# Altium schematic sheet MicroController.SchDoc
size A
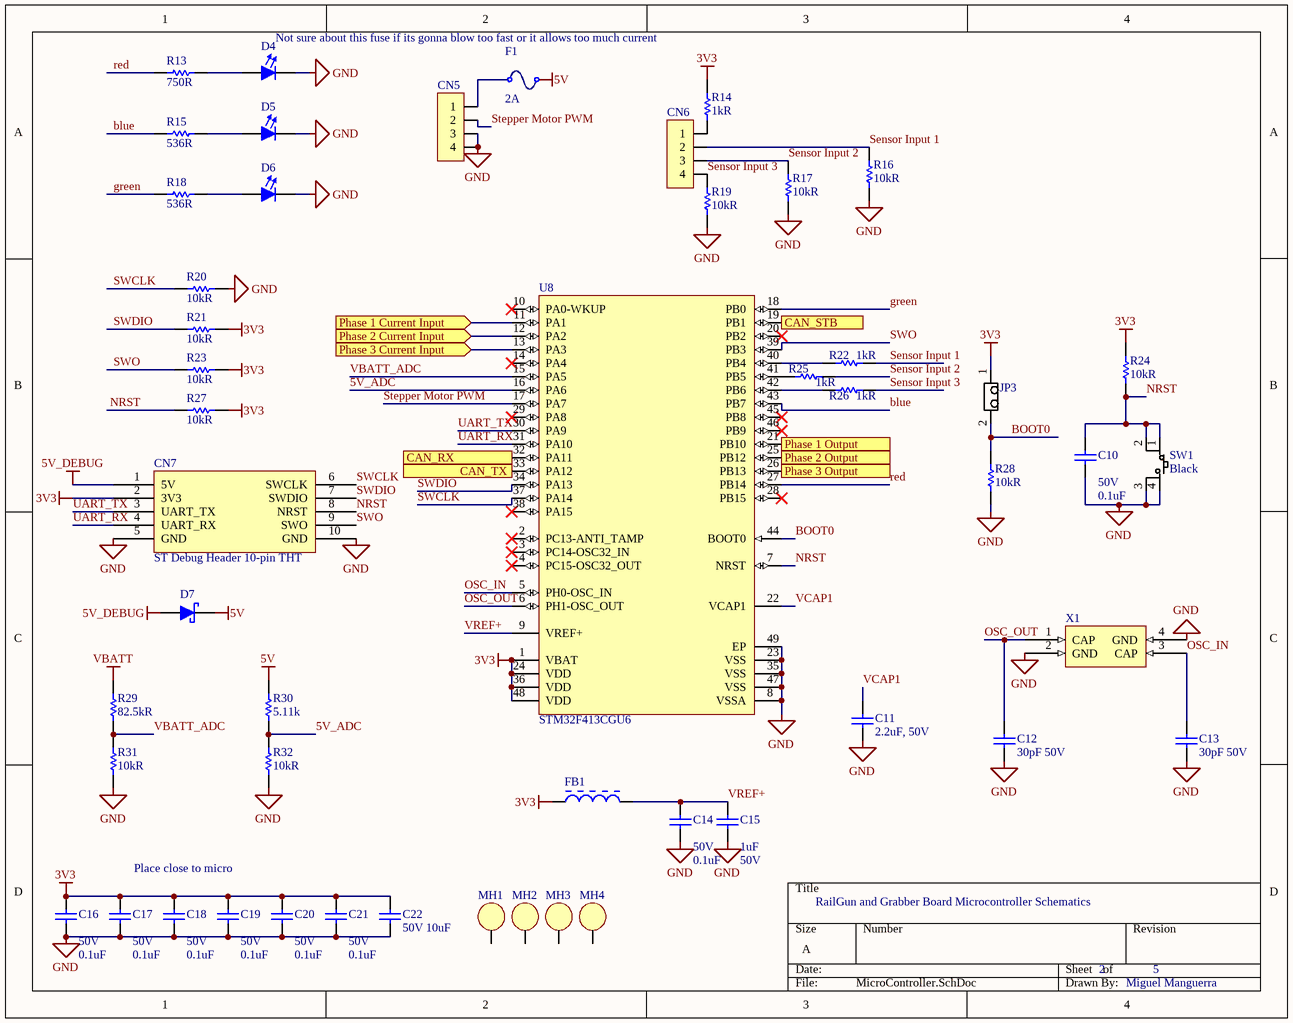
[diagram p0: MicroController.SchDoc]

## Parts
C10  Voltage: 50V  Capacitance: 0.1uF  [FP-CL10-0_1-MFG]  (hidden comment: CL10B104JB8NNNC)
C11  2.2uF, 50V  [CAPC1608N(0603")]
C12  30pF 50V  [CAPC1608N(0603")]
C13  30pF 50V  [CAPC1608N(0603")]
C14  Voltage: 50V  Capacitance: 0.1uF  [FP-CL10-0_1-MFG]  (hidden comment: CL10B104JB8NNNC)
C15  Capacitance: 1uF  Voltage: 50V  [0803 CAP]  (hidden comment: CL21B105KBFNNNG)
C16  Voltage: 50V  Capacitance: 0.1uF  [FP-CL10-0_1-MFG]  (hidden comment: CL10B104JB8NNNC)
C17  Voltage: 50V  Capacitance: 0.1uF  [FP-CL10-0_1-MFG]  (hidden comment: CL10B104JB8NNNC)
C18  Voltage: 50V  Capacitance: 0.1uF  [FP-CL10-0_1-MFG]  (hidden comment: CL10B104JB8NNNC)
C19  Voltage: 50V  Capacitance: 0.1uF  [FP-CL10-0_1-MFG]  (hidden comment: CL10B104JB8NNNC)
C20  Voltage: 50V  Capacitance: 0.1uF  [FP-CL10-0_1-MFG]  (hidden comment: CL10B104JB8NNNC)
C21  Voltage: 50V  Capacitance: 0.1uF  [FP-CL10-0_1-MFG]  (hidden comment: CL10B104JB8NNNC)
C22  50V 10uF  [CAPC3216X180X50LL20T30]
CN5  Header, Male, 1x4, RA, Pitch 0.1" (2.54mm)  [HEADER, MALE, SHROUDED, 4x1, PITCH 0.1" (2.54mm), RA]  (value not drawn)
CN6  Header, Male, 1x4, RA, Pitch 0.1" (2.54mm)  [HEADER, MALE, SHROUDED, 4x1, PITCH 0.1" (2.54mm), RA]  (value not drawn)
CN7  ST Debug Header 10-pin THT  [10-pin shrouded header THT]
D4  LSQ976-NR-1  [FP-LB_Q39E-MFG]  (value not drawn)
D5  LBQ39E-N1OO-35-1  [FP-LB_Q39E-MFG]  (value not drawn)
D6  LT Q39G-Q1OO-25-1  [FP-LB_Q39E-MFG]  (value not drawn)
D7  CUS08F30,H3F  [SC-76]  (value not drawn)
F1  Current: 2A  [1206 SMD]  (hidden comment: SMD Fuse, 2A, 63V,)
FB1  BLM18AG601SN1D  [MURA-BLM18-F-H1-CHIP-2_V]  (value not drawn)
JP3  1x2 Male Header  [2X1 Males Header]  (value not drawn)
MH1  Mount_Hole_3mm  [Mount-Hole_3mm]  (value not drawn)
MH2  Mount_Hole_3mm  [Mount-Hole_3mm]  (value not drawn)
MH3  Mount_Hole_3mm  [Mount-Hole_3mm]  (value not drawn)
MH4  Mount_Hole_3mm  [Mount-Hole_3mm]  (value not drawn)
R13  750R  [RESC0603(1608)_N]
R14  1kR  [RESC1608N(0603")]
R15  536R  [RESC1608X55X30LL15T15]
R16  10kR  [RESC1608N(0603")]
R17  10kR  [RESC1608N(0603")]
R18  536R  [RESC1608X55X30LL15T15]
R19  10kR  [RESC1608N(0603")]
R20  10kR  [RESC1608N(0603")]
R21  10kR  [RESC1608N(0603")]
R22  1kR  [RESC1608N(0603")]
R23  10kR  [RESC1608N(0603")]
R24  10kR  [RESC1608N(0603")]
R25  1kR  [RESC1608N(0603")]
R26  1kR  [RESC1608N(0603")]
R27  10kR  [RESC1608N(0603")]
R28  10kR  [RESC1608N(0603")]
R29  Resistance: 82.5kR  [RESC1608X55X30LL15T15]  (hidden comment: ERJ-3EKF8252V)
R30  value 5.11k  [RESC1608N(0603")]  (hidden comment: 5.11kR, 1%, 1/10W, 0603, SMD)
R31  Resistance: 10kR  [RESC1608X55X25NL10T15]  (hidden comment: RC0603FR-0710KL)
R32  Resistance: 10kR  [RESC1608X55X25NL10T15]  (hidden comment: RC0603FR-0710KL)
SW1  Button Colour: Black  [4-SPST-NO]  (hidden comment: PTS645SL43SMTR92LFS)
U8  STM32F413CGU6  [STM-UFQFPN48_N]
X1  CRYSTAL 8.0MHZ 16PF SMD  [QFN250P750X520X140_HS-5M]  (value not drawn)

## Ports
CAN_RX (in), CAN_STB (out), CAN_TX (out), Phase 1 Current Input (in), Phase 1 Output (out), Phase 2 Current Input (in), Phase 2 Output (out), Phase 3 Current Input (in), Phase 3 Output (out)

## Nets
3V3: C16.1 C17.1 C18.1 C19.1 C20.1 C21.1 C22.1 CN7.2(3V3) FB1.1 JP3.1 R14.1 R21.1 R23.1 R24.1 R27.1 U8.1(VBAT) U8.24(VDD) U8.36(VDD) U8.48(VDD)
5V: D7.K(Cathode) F1.2 R30.1
5V_DEBUG: CN7.1(5V) D7.A(Anode)
GND: C10.2 C11.2(Cathode) C12.2 C13.2 C14.2 C15.2 C16.2 C17.2 C18.2 C19.2 C20.2 C21.2 C22.2 CN5.3 CN5.4 CN7.5(GND) CN7.10(GND) D4.1(Cathode) D5.1(Cathode) D6.1(Cathode) R16.2 R17.2 R19.2 R20.1 R28.2 R31.2 R32.2 SW1.3 SW1.4 U8.8(VSSA) U8.23(VSS) U8.35(VSS) U8.47(VSS) U8.49(EP) X1.2(GND) X1.4(GND)
VBATT: R29.1
5V_ADC: R30.2 R32.1 U8.16(PA6)
blue: R15.1 U8.43(PB7)
BOOT0: JP3.2 R28.1 U8.44(BOOT0)
CAN_RX: U8.32(PA11) ; port CAN_RX
CAN_STB: U8.19(PB1) ; port CAN_STB
CAN_TX: U8.33(PA12) ; port CAN_TX
green: R18.1 U8.18(PB0)
NRST: C10.1 CN7.8(NRST) R24.2 R27.2 SW1.1 SW1.2 U8.7(NRST)
OSC_IN: C13.1 U8.5(PH0-OSC_IN) X1.3(CAP)
OSC_OUT: C12.1 U8.6(PH1-OSC_OUT) X1.1(CAP)
Phase 1 Current Input: U8.11(PA1) ; port Phase 1 Current Input
Phase 1 Output: U8.21(PB10) ; port Phase 1 Output
Phase 2 Current Input: U8.12(PA2) ; port Phase 2 Current Input
Phase 2 Output: U8.25(PB12) ; port Phase 2 Output
Phase 3 Current Input: U8.13(PA3) ; port Phase 3 Current Input
Phase 3 Output: U8.26(PB13) ; port Phase 3 Output
red: R13.1 U8.27(PB14)
Sensor Input 1: CN6.2 R16.1 R22.2
Sensor Input 2: CN6.3 R17.1 R25.2
Sensor Input 3: CN6.4 R19.1 R26.2
Stepper Motor PWM: CN5.2 U8.17(PA7)
SWCLK: CN7.6(SWCLK) R20.2 U8.37(PA14)
SWDIO: CN7.7(SWDIO) R21.2 U8.34(PA13)
SWO: CN7.9(SWO) R23.2 U8.39(PB3)
UART_RX: CN7.4(UART_RX) U8.31(PA10)
UART_TX: CN7.3(UART_TX) U8.30(PA9)
VBATT_ADC: R29.2 R31.1 U8.15(PA5)
VCAP1: C11.1(Anode) U8.22(VCAP1)
VREF+: C14.1 C15.1 FB1.2 U8.9(VREF+)
NetCN5_1: CN5.1 F1.1
NetCN6_1: CN6.1 R14.2
NetD4_2: D4.2(Anode) R13.2
NetD5_2: D5.2(Anode) R15.2
NetD6_2: D6.2(Anode) R18.2
NetR22_1: R22.1 U8.40(PB4)
NetR25_1: R25.1 U8.41(PB5)
NetR26_1: R26.1 U8.42(PB6)

Not connected (* = marked no-connect by the designer): MH1 1; MH2 1; MH3 1; MH4 1; U8 2(PC13-ANTI_TAMP)* 3(PC14-OSC32_IN)* 4(PC15-OSC32_OUT)* 10(PA0-WKUP)* 14(PA4)* 20(PB2)* 28(PB15)* 29(PA8)* 38(PA15)* 45(PB8)* 46(PB9)*

## Notes on the sheet
- Not sure about this fuse if its gonna blow too fast or it allows too much current
- Place close to micro
- RailGun and Grabber Board Microcontroller Schematics
- 2
- 5
- Miguel Manguerra

## Library data of the parts
C10 C14 C16-C21 = CMP-00000-3: CAP CER 0.1UF 50V X7R 0603; Tolerance: 5%; Material: Ceramic; Case Code (Imperial): 0603; Mount: Surface Mount; Thickness: 0.035inch; Depth: 0.8mm; Packaging: Tape and Reel; Package Quantity: 1; Dielectric: X7R; Height: 0.8mm; Radiation Hardening: No; Max Operating Temperature: 125°C; Voltage Rating: 50V; Case/Package: 0603; Min Operating Temperature: -55°C; Case Code (Metric): 1608; Length: 1.6mm; Contact Plating: Tin; Width: 0.031inch
C11 = CMP-006-0030-1: Capacitor, Ceramic, 50V, 10%, 0603 SMD, X5R; Value: 2.2µF; Date Created: *; Design Item ID: 2.2uF, 50V, 0603 SMD, X5R, Ceramic; Made By: *; Publisher: AUVic; Source: AUVic_Schematic_Library_Capacitors.SchLib; Pin Count: 2; PackageDescription: Chip Capacitor; Component Type: Standard
C12 C13 = CMP-006-0040-1: Capacitor, Ceramic, 50V, +/-1%, 0603 SMD, C0G; Made By: Andy Bates; Design Item ID: 30pF 50V 0603 SMD, Ceramic; Value: 30pF; PackageDescription: Chip Capacitor; Source: AUVic_Schematic_Library_Capacitors.SchLib; Publisher: AUVic; Pin Count: 2; Published: 16-09-12; Component Type: Standard
C15 = CMP-00005-1: SAMSUNG ELECTRO-MECHANICS - CL21B105KBFNNNG - MLCC CAPACITORS; Tolerance: 10%; Material: Ceramic; Dielectric: X7R; Case/Package: 0805; Voltage Rating: 50V; Contact Plating: Tin; Max Operating Temperature: 125°C; Termination: Wraparound; Package Quantity: 3000; Depth: 1.25mm; Mount: Surface Mount; Min Operating Temperature: -55°C; Thickness: 0.053inch; Packaging: Tape and Reel; Case Code (Metric): 2012; Length: 2mm; Case Code (Imperial): 0805; Width: 0.049inch
C22 = CMP-00004-1: Cap Ceramic 10uF 50V X7R 10% Pad SMD 1206 125°C T/R; Thickness: 0.071inch; Case/Package: 1206; Case Code (Metric): 3216; Case Code (Imperial): 1206; Voltage Rating: 50V; Length: 0.126inch; Max Operating Temperature: 125°C; Voltage Rating (DC): 50V; Capacitance: 10uF; Dielectric: X7R; Lead Free: Lead Free; Min Operating Temperature: -55°C; Tolerance: 10%; Mount: Surface Mount; Packaging: Tape and Reel; Width: 0.063inch
CN5 CN6 = CMP-005-0029-3: Connector Header Through Hole, Right Angle 4 position 0.100" (2.54mm); Source: AUVic_Schematic_Library_Connectors.SchLib; Created On: 2020-05-20; Pin Count: 4; Component Type: Standard; Design Item ID: Header, Male, 1x4, RA, Pitch 0.1" (2.54mm); Created By: Miguel Manguerra
CN7 = CMP-00011-6: CONN HEADER VERT 10POS 2.54MM; Row Spacing: 0.1inch; Connector Type: Male Pin; Number of Positions: 10; Packaging: Tray; Package Quantity: 1; Color: Black; Number of Rows: 2; Termination: Solder; Contact Plating: Gold; Lead Free: Lead Free; Pitch: 0.1inch; Mount: Through Hole
D4 = CMP-00066-2: LED Red 645nm 2-Pin Chip 0603(1608Metric) T/R; Lens Transparency: Diffused; Power Dissipation: 65mW; Forward Voltage: 2.5V; Dominant Wavelength: 633nm; Number of Elements: 1; Lens Style: Diffused,Flat,Colorless,Rectangular; Lens Color: White; Viewing Angle: 160°; Luminous Flux: 0.33lm; Test Current: 20mA; Forward Current: 25mA; Luminous Intensity: 180mcd; Reverse Voltage: 12V; Lens Size: 0.8mm; Max Operating Temperature: 85°C; Depth: 0.9mm; Illumination Color: Red; Color: Red; Packaging: Tape and Reel; Min Operating Temperature: -30°C; Case Code (Imperial): 0603; Case Code (Metric): 1608; Number of Pins: 2; Mount: Surface Mount; Height: 0.8mm; Package Quantity: 1; Length: 1.7mm; Width: 0.8mm; Number of LEDs: 1; Case/Package: 0603; Radiation Hardening: No
D5 = CMP-00063-3: LED BLUE DIFFUSED 0603 SMD; Luminous Flux: 0.13lm; Lens Size: 0.8mm; Lens Color: White; Viewing Angle: 130°; Luminous Intensity: 42mcd; Number of LEDs: 1; Dominant Wavelength: 470nm; Lens Style: Flat,Diffused,Colorless,Rectangular; Test Current: 5mA; Forward Voltage: 2.85V; Packaging: Tape and Reel; Case/Package: 0603; Height: 0.4mm; Number of Pins: 2; Mount: Surface Mount; Case Code (Metric): 1608; Case Code (Imperial): 0603; Lens Transparency: Diffused; Width: 0.8mm; Length: 1.6mm; Color: Blue; Radiation Hardening: No
D6 = CMP-00064-3: LED GREEN DIFFUSED 0603 SMD; Dominant Wavelength: 530nm; Luminous Intensity: 280mcd; Lens Style: Diffused,Colorless,Rectangular; Number of LEDs: 1; Forward Voltage: 2.85V; Test Current: 5mA; Reverse Voltage: 5V; Forward Current: 15mA; Luminous Flux: 0.55lm; Radiation Hardening: No; Packaging: Tape and Reel; Mount: Surface Mount; Color: Green; Max Operating Temperature: 85°C; Number of Elements: 1; Number of Pins: 2; Min Operating Temperature: -40°C; Depth: 0.9mm; Case/Package: SMD/SMT; Length: 1.7mm
D7 = CMP-057-0000-2: Diode Schottky 30V 800mA Surface Mount USC; Peak Non-Repetitive Surge Current: 5A; Element Configuration: Single; Peak Reverse Current: 50uA; Packaging: Tape and Reel; Mount: Surface Mount; Average Rectified Current: 800mA; Case/Package: SOD; Max Reverse Voltage (DC): 30V; Min Operating Temperature: -55°C; Contact Plating: Tin,Silver; Max Repetitive Reverse Voltage (Vrrm): 30V; Number of Pins: 2; Max Operating Temperature: 125°C
F1 = CMP-027-0004-1: Design Item ID: SMD Fuse, 2A, 63V,; Component Type: Standard; Source: AUVic_Integrated_Library_Fuses.SchLib; ComponentLink1Description: Digi-Key; Date Created: 2018-06-07; ComponentLink1URL: https://www.digikey.ca/product-detail/en/bel-fuse-inc/C1F-2/507-1881-1-ND/4968159; Type: SMD; Created By: Poorna Chander Kalidas; Pin Count: 2
FB1 = CMP-00016-1: MURATA - BLM18AG601SN1D - Feritový Korálek, 0603 / 1608, 600 ohm, 500 mA, Série BLM18A, 0.38 ohm, ± 25%; DC Current: 500mA; Impedance: 600R; DC Resistance (DCR): 380mR; Core Material: Ferrite; Shielding: Unshielded; Number of Lines: 1; Test Frequency: 100MHz; Material: Steel,Ferrite; Height: 0.8mm; Depth: 0.8mm; Min Operating Temperature: -55°C; Packaging: Tape and Reel; Weight: 7.1E-05oz; Width: 0.8mm; Military Standard: Not; Max Operating Temperature: 125°C; Max Current Rating: 500mA; Case Code (Metric): 1608; Length: 1.6mm; Case Code (Imperial): 0603; Package Quantity: 1; Max DC Current: 500mA; REACH SVHC: No SVHC; Termination: SMD/SMT; Current Rating: 500mA; Lead Free: Lead Free; Tolerance: 25%; Case/Package: 0603; Number of Pins: 2; Radiation Hardening: No; Frequency: 100MHz; Number of Circuits: 1
JP3 = CMP-004-0001-1: Made By: Andy Bates; Source: AUVic_Schematic_Library_Connectors.SchLib; Pin Count: 2; Design Item ID: 1x2 Male Header; Component Type: Standard
MH1-MH4 = CMP-004-0010-4: Mounting hold for M3 hex standoff; Source: AUVic_Schematic_Library_Connectors.SchLib; Design Item ID: Mount_Hole_3mm; Component Type: Standard; Pin Count: 1
R13 = CMP-00070-1: Res Thick Film 0603 750 Ohm 1% 0.1W(1/10W) ±100ppm/C Epoxy SMD T/R; Voltage Rating (DC): 50V; Power Rating: 100mW; Temperature Coefficient: 100ppm/°C; Height: 0.022inch; Tolerance: 1%; Voltage Rating: 50V; Case Code (Metric): 1608; Packaging: Tape and Reel; Depth: 0.8mm; Package Quantity: 1; Termination: SMD/SMT; Number of Terminations: 2; Min Operating Temperature: -55°C; Case/Package: 0603; Composition: Thick Film; Width: 0.031inch; Max Operating Temperature: 155°C; Max Power Dissipation: 100mW; Length: 1.6mm; Resistance: 750R; Military Standard: Not; Features: Moisture Resistant; Case Code (Imperial): 0603; Lead Free: Lead Free
R14 R22 R25 R26 = CMP-047-0024-1: 1kR, 1%, 1/10W , 0603, SMD; Value: 1k; Component Type: Standard; Publisher: AUVic; Source: AUVic_Schematic_Library_Resistors.SchLib; Date Created: 2017-05-10; Pin Count: 2; Created By: Andy Bates; Design Item ID: 1kR
R15 R18 = CMP-00071-1: SMD Chip Resistor, 0603 [1608 Metric], 536 ohm, ERJ3EK Series, 75 V, Thick Film, 100 mW; Tolerance: 1%; Voltage Rating (DC): 50V; Voltage Rating: 75V; Power Rating: 100mW; Temperature Coefficient: 100ppm/°C; Max Operating Temperature: 155°C; Package Quantity: 1; REACH SVHC: No SVHC; Depth: 0.8mm; Composition: Thick Film; Height: 0.022inch; Packaging: Tape and Reel; Contact Plating: Tin; Lead Free: Lead Free; Length: 1.6mm; Case/Package: 0603; Military Standard: Not; Features: Automotive AEC-Q200; Resistance: 536R; Termination: SMD/SMT; Max Power Dissipation: 100mW; Width: 0.8mm; Mount: Surface Mount; Case Code (Metric): 1608; Case Code (Imperial): 0603; Number of Terminations: 2; Min Operating Temperature: -55°C
R16 R17 R19-R21 R23 R24 R27 R28 = CMP-047-0013-1: 10kR, 1%, 1/10W, 0603 SMD; Owned By: AUVic; Made By: Ashwin Sira; Value: 10k; Design Item ID: 10kR; Pin Count: 2; Component Type: Standard; Created On: 14-05-31; Last Edited: 14-05-31; Source: AUVic_Schematic_Library_Resistors.SchLib
R29 = CMP-00085-1: RES SMD 82.5K OHM 1% 1/10W 0603; Power Rating: 100mW; Temperature Coefficient: 100ppm/°C; Voltage Rating (DC): 50V; Voltage Rating: 75V; Case/Package: 0603; Case Code (Imperial): 0603; Composition: Thick Film; Depth: 0.8mm; Min Operating Temperature: -55°C; Width: 0.031inch; Height: 0.022inch; Military Standard: Not; Packaging: Tape and Reel; Termination: SMD/SMT; Lead Free: Lead Free; Max Operating Temperature: 155°C; REACH SVHC: No SVHC; Case Code (Metric): 1608; Tolerance: 1%; Length: 1.6mm; Features: Automotive AEC-Q200; Package Quantity: 1; Max Power Dissipation: 100mW; Radiation Hardening: No; Contact Plating: Tin; Number of Terminations: 2; Mount: Surface Mount
R30 = CMP-047-0056-1: Resistance, Tolerance, Power, 0603, SMD/THT; Publisher: AUVic; Design Item ID: 5.11kR, 1%, 1/10W, 0603, SMD; Date Created: 09/28/2016; Pin Count: 2; Component Type: Standard; Created By: Jordan Day; Source: AUVic_Schematic_Library_Resistors.SchLib
R31 R32 = CMP-00037-1: Res General Purpose Thick Film 0603 10K Ohm 1% 1/10W ±100ppm/°C Molded SMD Paper T/R; Power Rating: 100mW; Voltage Rating (DC): 50V; Voltage Rating: 75V; Case/Package: 0603; Weight: 7.1E-05oz; Case Code (Imperial): 0603; Composition: Thick Film; Depth: 0.8mm; Min Operating Temperature: -55°C; Width: 0.8mm; Height: 0.45mm; Military Standard: Not; Packaging: Tape and Reel; Termination: SMD/SMT; Lead Free: Lead Free; Temperature Coefficient: 100ppm/°C; Number of Pins: 2; Max Operating Temperature: 155°C; Lead Pitch: 0.3mm; REACH SVHC: No SVHC; Case Code (Metric): 1608; Tolerance: 1%; Length: 1.6mm
SW1 = CMP-00077-1: Black Switch Tactile N.O. SPST Round Button Gull Wing 0.05A 12VDC 100000Cycles 1.27N SMD T/R; Actuator Material: Nylon,Polyamide; Switch Function: Off-Mom; Actuator Type: Standard; Illumination Type: Non-Illuminated; Max Voltage Rating (DC): 12V; Current Rating: 50mA; Actuator Length: 0.85mm; Contact Resistance: 100mR; Depth: 9mm; Length: 6mm; Termination: Gull Wing; Max Operating Temperature: 60°C; Mechanical Life: 100000Cycles; Packaging: Tape and Reel; Color: Black; Throw Configuration: SPST; Min Operating Temperature: -20°C; Mount: Surface Mount; Lead Free: Lead Free; Operating Force: 1.27N; Contact Material: Bronze,Brass,Silver; Max Current Rating: 50mA; Package Quantity: 1000; Voltage Rating (DC): 12V; Contact Plating: Silver; Orientation: Straight
U8 = CMP-00009-1: MCU 32-Bit STM32 ARM Cortex M4 RISC 1MB Flash 1.8V/2.5V/3.3V 48-Pin UFQFPN Tray; Number of I/Os: 36; Frequency: 100MHz; Interface: I2C,USB,IrDA,MMC,SDIO,UART,USART; Oscillator Type: Internal; Peripherals: Brown-out Detect/Reset,POR,PWM,WDT,DMA,LCD; Memory Type: FLASH; Case/Package: UFQFPN; Memory Size: 1MB; Min Operating Temperature: -40°C; Max Operating Temperature: 85°C; Core Architecture: ARM; Packaging: Tray
X1 = CMP-00079-1: 8MHz ±30ppm Crystal 16pF 80 Ohms 4-SMD, No Lead; Frequency Stability: 50ppm; ESR (Equivalent Series Resistance): 80R; Packaging: Tape and Reel; Min Operating Temperature: -20°C; Length: 7.5mm; Case/Package: CSMD; Max Operating Temperature: 70°C; Load Capacitance: 16pF; Depth: 5.2mm; Frequency: 8MHz; Number of Pins: 4